# EAGLE design NorthStar SuperCap V0.2 (EAGLE 9.5.1)
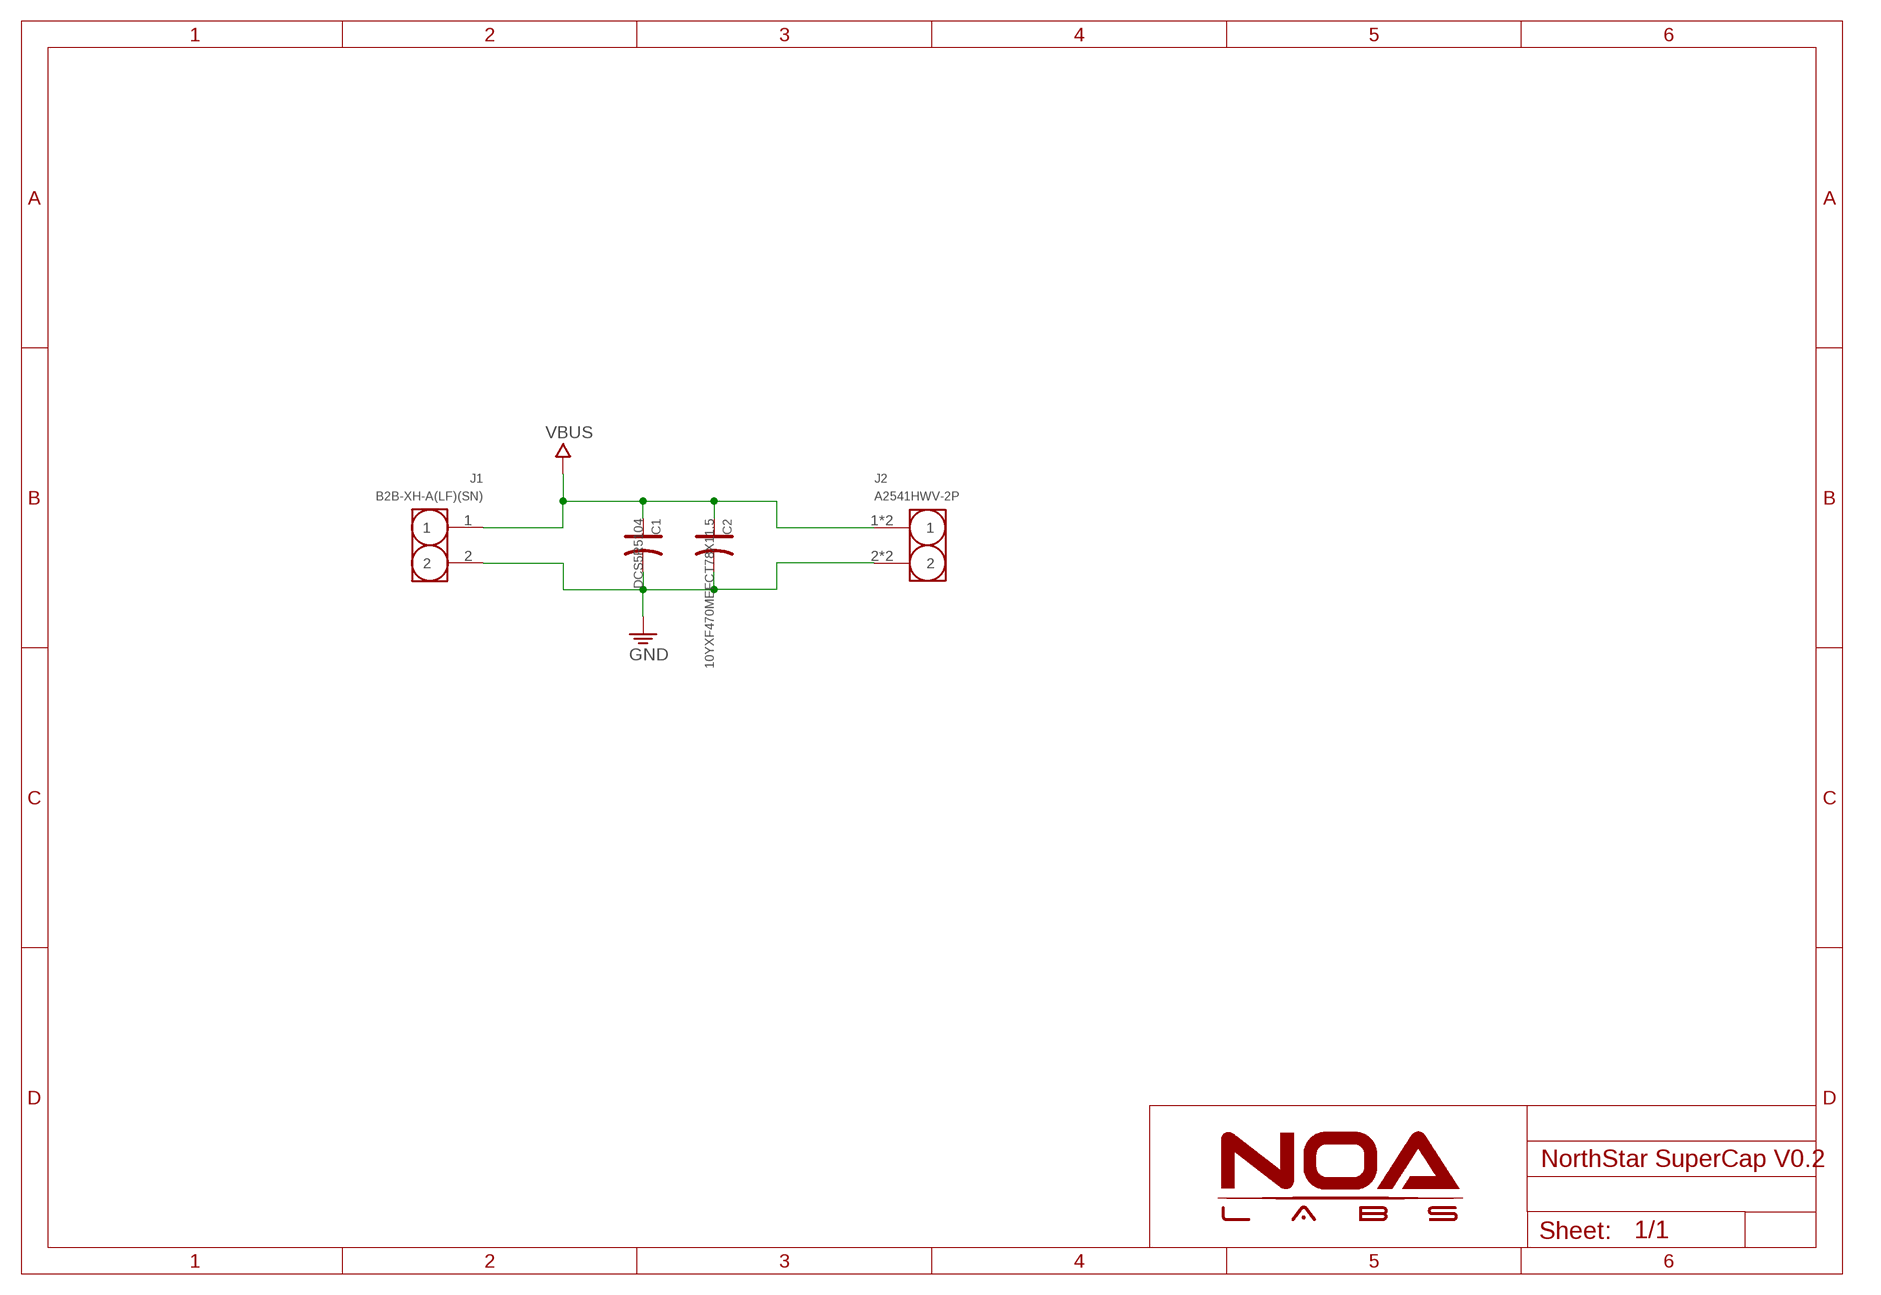
[diagram p0: schematic, sheet 1]

## Parts
C1  DCS5R5104  CAP-H-TYPE  [11.5X5.5MM-P10]
C2  10YXF470MEFCT78X11.5  CAP-D8.0/3.81  [ELECTRO-8.0MM]
J1  B2B-XH-A(LF)(SN)  HEADER-2P-90DEG-FEMALE  [XH-02-90]
J2  A2541HWV-2P  HEADER-2P-FEMALE  [2P-2.54-BOTTOM-ENTRY]

## Nets
GND: C1.2(-) C2.- J1.2 J2.2 J2.2-2
VBUS: C1.1(+) C2.+ J1.1 J2.1 J2.1-1

## Library data of the parts
C1 C2 = RCL:CAP: Electrolytic Capacitors,Tantalum Capacitors and Super Capacitors
J1 J2 = Connector_NOA:HEADER-2P

## Board
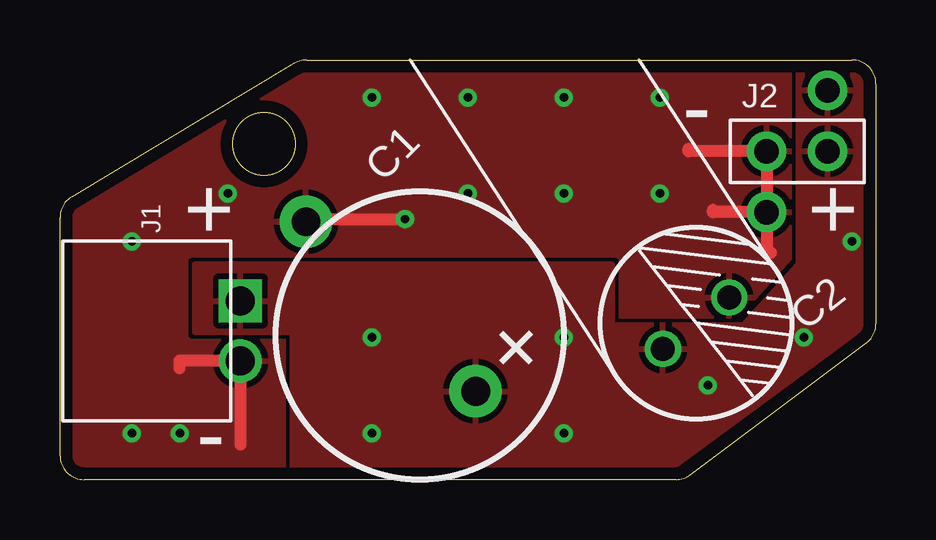
[diagram p1: board, top side]
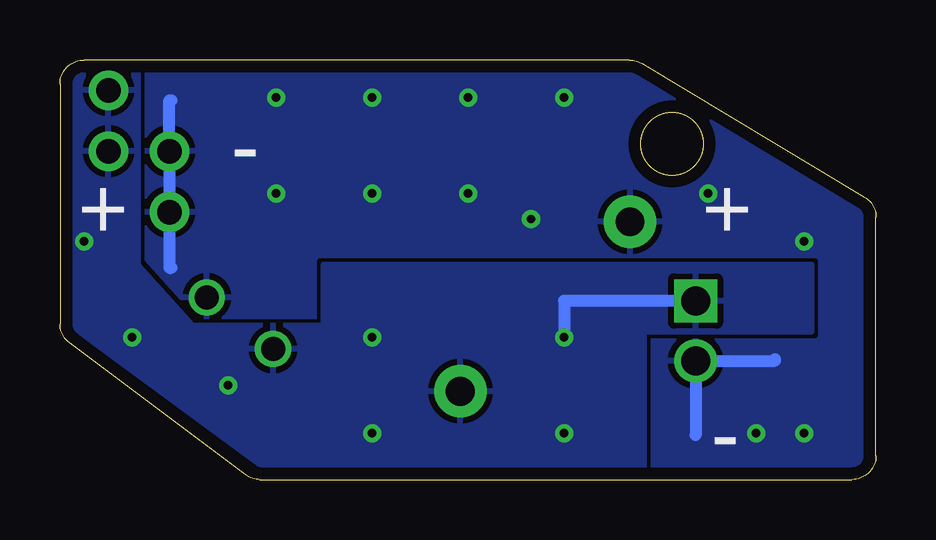
[diagram p2: board, bottom side, seen from below]

Size 34 x 17.5 mm. Coordinates in mm from the lower left corner, seen from the top.
Outline: 34,16.5 arc90 33,17.5 10.28,17.5 arc31 9.76,17.36 0.49,11.79 arc59 0,10.93 0,1 arc90 1,0 25.67,0 arc37 26.27,0.2 33.6,5.7 arc53 34,6.5 34,16.5
Outline: circle at 8.5,14 radius 1.3
Copper layers (1*16): Top 0.035mm / dielectric 0.93mm / Bottom 0.035mm
Design rules "default *": minimum track width 6mil, minimum drill 0.35mm, track to track 6mil, track to pad 6mil, pad to pad 6mil, via to via 6mil, smd to smd 6mil, copper to edge 20mil, drill to drill 6mil, minimum pad ring 10mil, minimum via ring 8mil, stop-mask expansion 4mil, vias tented up to drill 0mil, thermal gap 10mil

### Footprints (pad centres in the part's own frame; a part is rotated, then mirrored left to right if it is on the bottom)
11.5X5.5MM-P10 = drill 1.2 pad 2.184: 1 3.3,0; 2 -6.7,0
ELECTRO-8.0MM = drill 1: + -1.75,0; - 1.75,0
XH-02-90 = drill 1.2 square: 1 1.25,0 | drill 1.2: 2 -1.25,0
2P-2.54-BOTTOM-ENTRY = drill 1.02 pad 1.651: 1 -1.27,-2.54; 1-1 -1.27,0; 2 1.27,2.54; 2-2 1.27,0

### Placement (x,y rotation side)
C1  14.98,6.01 315 top
C2  26.5,6.52 38 top
J1  7.52,6.2 90 top
J2  30.71,13.69 180 top

### Tracks (layer width: path | path; a pad name or v marks a point on that pad's centre or on a via)
GND  (via drill 0.35)
  Top 0.508: 4.98,4.64 4.98,4.95 J1.2 7.52,1.47 | 26.19,13.79 26.19,13.7 J2.2-2 J2.2 | J2.2 27.2,11.16 27.2,11.25 | J2.2 29.44,9.47 29.61,9.47 | C1.2 10.13,10.87 v14.37,10.87
  Bottom 0.508: 4.21,5.02 4.21,4.95 J1.2 7.52,1.85 | 29.36,15.82 29.44,15.82 J2.2-2 29.44,8.83 29.36,8.83
  other vias: 12.99,15.93 16.99,15.93 20.99,15.93 24.99,15.93 20.99,11.93 24.99,11.93 16.99,11.93 6.99,11.93 2.99,9.93 4.99,1.93 2.99,1.93
  pour Bottom (rank 2): -1.88,20.14 -1.88,-1.07 36.47,-1.07 36.47,20.14
  pour Top (rank 2): -1.88,20.14 -1.88,-1.07 36.47,-1.07 36.47,20.14
VBUS  (via drill 0.35)
  Bottom 0.508: J1.1 12.99,7.45 v12.99,5.93
  other vias: 20.99,5.93 20.99,1.93 12.99,1.93 26.99,3.93 32.99,9.93 30.99,5.93
  pour Top: 30.76,16.96 30.76,8.96 28.47,6.42 23.01,6.42 23.01,8.96 5.61,8.96 5.61,6.17 9.68,6.17 9.68,0.45 25.42,0.45 33.55,6.42 33.55,16.96
  pour Bottom: 30.76,16.96 30.76,8.96 28.47,6.42 23.01,6.42 23.01,8.96 2.69,8.96 2.69,6.17 9.68,6.17 9.68,0.45 25.42,0.45 33.55,6.42 33.55,16.96

### Text on the board
tPlace: - | + | + | -
bPlace: - | + | + | -